# EAGLE design Board_MIL_AND_RIGHT_PROTO_V2_Mob_Project (EAGLE 9.5.0)
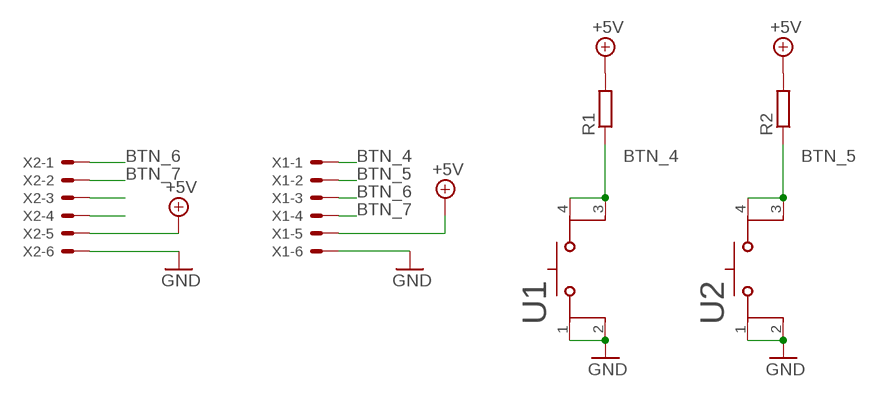
[diagram p0: schematic, sheet 1]

## Parts
R1  R-EU_M0805  [M0805]
R2  R-EU_M0805  [M0805]
U1  4-1437565-1  [SW4_236X236H5MM]
U2  4-1437565-1  [SW4_236X236H5MM]
X1  C-GRID-06-70543  [70543-06]
X2  C-GRID-06-70543  [70543-06]

## Nets
+5V: R1.2 R2.2 X1.5 X2.5
BTN_4: R1.1 U1.3 U1.4 X1.1
BTN_5: R2.1 U2.3 U2.4 X1.2
BTN_6: X1.3 X2.1
BTN_7: X1.4 X2.2
GND: U1.1 U1.2 U2.1 U2.2 X1.6 X2.6
N$7: X2.3
N$8: X2.4

## Library data of the parts
R1 R2 = resistor:R-EU_: RESISTOR, European symbol
U1 U2 = Switches:4-1437565-1; BUILT_BY: EMA_UL_Team; CATEGORY: Tactile Switches; COPYRIGHT: Copyright (C) 2016 Accelerated Designs. All rights reserved; DESCRIPTION: FSM4JSMA=SMT,TACTILE,PB SWITCH; MANUFACTURER_PART_NUMBER: 4-1437565-1; PART_STATUS: active; SERIES: Alcoswitch FSMJSMA; VENDOR: TE Connectivity
X1 X2 = con-molex:C-GRID-06: CONNECTOR wire to board 2.54 mm (0.100") pitch header; MF: MOLEX; OC_FARNELL: unknown; OC_NEWARK: unknown

## Board
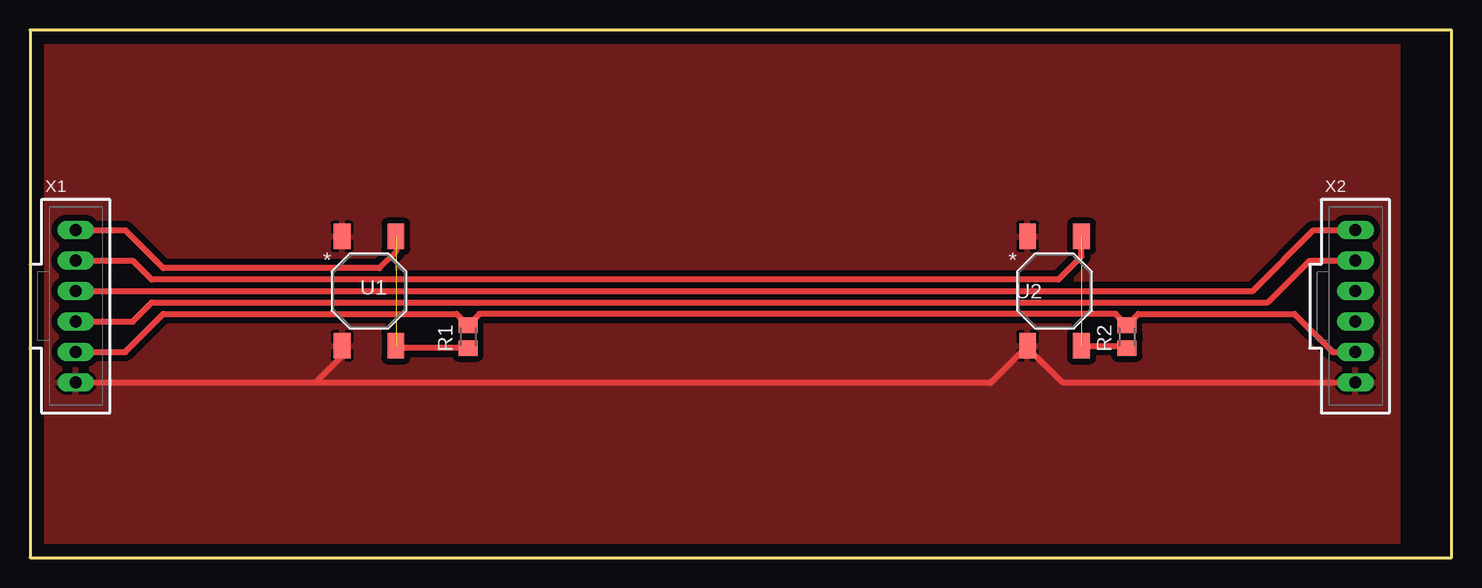
[diagram p1: board, top side]
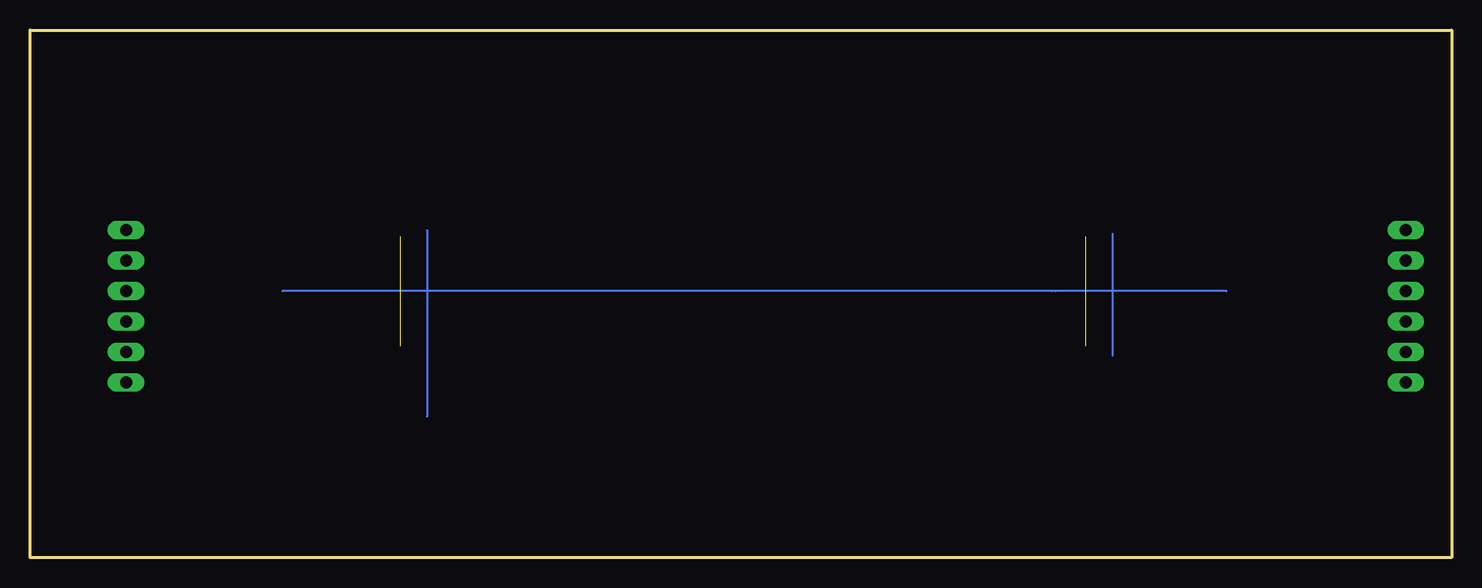
[diagram p2: board, bottom side, seen from below]

Size 118.5 x 44 mm. Coordinates in mm from the lower left corner, seen from the top.
Outline: 118.5,44 0,44 0,0 118.5,0 118.5,44
Copper layers (1*16): Top 0.035mm / dielectric 1.5mm / Bottom 0.035mm
Design rules "default": minimum track width 6mil, minimum drill 0.35mm, track to track 6mil, track to pad 6mil, pad to pad 6mil, via to via 6mil, smd to smd 6mil, copper to edge 40mil, drill to drill 6mil, minimum pad ring 10mil, minimum via ring 8mil, stop-mask expansion 4mil, vias tented up to drill 0mil, thermal gap 10mil

### Footprints (pad centres in the part's own frame; a part is rotated, then mirrored left to right if it is on the bottom)
M0805 = smd 1.3 x 1.6: 1 -0.95,0; 2 0.95,0
SW4_236X236H5MM = smd 1.397 x 2.108: 1 -2.248,4.559; 2 -2.248,-4.559; 3 2.248,4.559; 4 2.248,-4.559
70543-06 = drill 1.016 long: 1 -6.35,0; 2 -3.81,0; 3 -1.27,0; 4 1.27,0; 5 3.81,0; 6 6.35,0

### Placement (x,y rotation side)
R1  36.51,18.41 90 top
R2  91.44,18.41 90 top
U1  28.26,22.23 0 top
U2  85.41,22.23 0 top
X1  3.81,20.95 270 top
X2  110.49,20.95 270 top

### Tracks (layer width: path | path; a pad name or v marks a point on that pad's centre or on a via)
+5V
  Top 0.508: X1.5 7.94,17.14 11.11,20.32 35.56,20.32 R1.2 37.47,20.32 90.49,20.32 R2.2 92.39,20.32 105.41,20.32 108.58,17.14 X2.5
BTN_4  (1 unrouted)
  Top 0.508: X1.1 7.94,27.3 11.11,24.13 29.12,24.13 30.51,25.51 U1.3 | R1.1 30.71,17.46 U1.4
BTN_5  (1 unrouted)
  Top 0.508: X1.2 8.57,24.77 10.16,23.18 85.72,23.18 87.66,25.11 U2.3 | U2.4 91.24,17.67 R2.1
BTN_6
  Top 0.508: X2.1 107,27.3 101.92,22.23 X1.3
BTN_7
  Top 0.508: X1.4 8.57,19.68 10.16,21.27 103.19,21.27 106.68,24.77 X2.2
GND
  Top 0.508: X2.6 86.04,14.61 83.16,17.49 U2.2 80.05,14.56 80.01,14.61 23.81,14.61 | X1.6 23.81,14.61 | U1.2 26.01,16.8 23.81,14.61
  pour Top (isolate 0.508): 0,0 0,44.13 113.98,44.13 113.98,0
N$1
  Bottom 0.152: 28.26,26.99 28.26,16.83
N$2
  Bottom 0.152: 18.73,22.23 33.02,22.23 33.34,22.23 97.47,22.23
N$3
  Bottom 0.152: 85.41,27.3 85.41,11.75